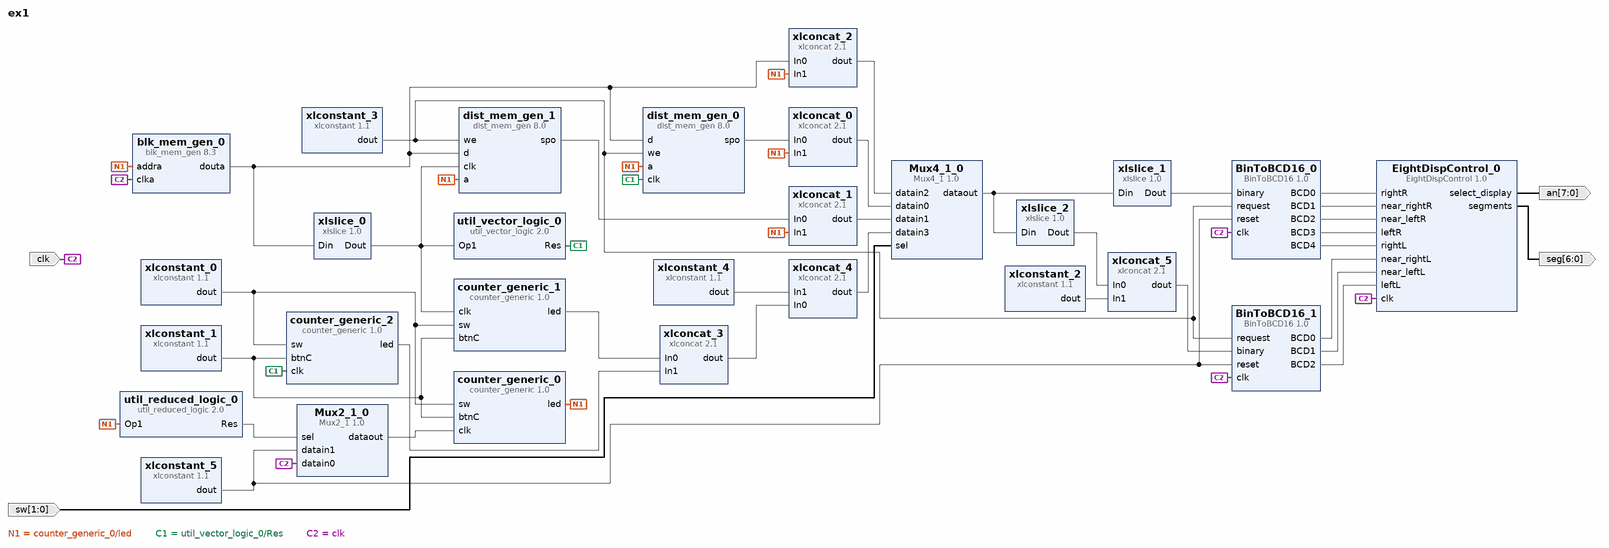
[diagram p0: block diagram of the top level]
# Vivado block design ex1, xc7a100tcsg324-3, Vivado 2016.4
create_bd_design ex1

create_bd_port -dir I clk
create_bd_port -dir I -from 1 -to 0 sw
create_bd_port -dir O -from 6 -to 0 seg
create_bd_port -dir O -from 7 -to 0 an

create_bd_cell -type ip -vlnv xilinx.com:ip:blk_mem_gen:8.3 blk_mem_gen_0
set_property -dict [list \
  CONFIG.Memory_Type Single_Port_ROM \
  CONFIG.Enable_32bit_Address false \
  CONFIG.Write_Width_A 16 \
  CONFIG.Enable_A Always_Enabled \
  CONFIG.Register_PortA_Output_of_Memory_Primitives true \
  CONFIG.Load_Init_File true \
  CONFIG.Coe_File ../../../../../../vector128_16bits_random.coe \
  CONFIG.Fill_Remaining_Memory_Locations true \
  CONFIG.Use_RSTA_Pin false \
  CONFIG.Port_A_Write_Rate 0 \
  CONFIG.use_bram_block Stand_Alone \
] [get_bd_cells blk_mem_gen_0]
create_bd_cell -type ip -vlnv xilinx.com:ip:dist_mem_gen:8.0 dist_mem_gen_0
set_property -dict {CONFIG.depth 128} [get_bd_cells dist_mem_gen_0]
create_bd_cell -type ip -vlnv xilinx.com:ip:dist_mem_gen:8.0 dist_mem_gen_1
set_property -dict {CONFIG.depth 128} [get_bd_cells dist_mem_gen_1]
create_bd_cell -type ip -vlnv xilinx.com:ip:xlslice:1.0 xlslice_0
set_property -dict {CONFIG.DIN_TO 0 CONFIG.DIN_FROM 0 CONFIG.DIN_WIDTH 16} [get_bd_cells xlslice_0]
create_bd_cell -type ip -vlnv xilinx.com:user:counter_generic:1.0 counter_generic_0
set_property -dict {CONFIG.nr_bits 7} [get_bd_cells counter_generic_0]
create_bd_cell -type ip -vlnv xilinx.com:ip:xlconstant:1.1 xlconstant_0
set_property -dict {CONFIG.CONST_WIDTH 2} [get_bd_cells xlconstant_0]
create_bd_cell -type ip -vlnv xilinx.com:ip:xlconstant:1.1 xlconstant_1
set_property -dict {CONFIG.CONST_VAL 0} [get_bd_cells xlconstant_1]
create_bd_cell -type ip -vlnv xilinx.com:user:Mux4_1:1.0 Mux4_1_0
set_property -dict {CONFIG.number_of_bits 23} [get_bd_cells Mux4_1_0]
create_bd_cell -type ip -vlnv xilinx.com:ip:xlconcat:2.1 xlconcat_0
set_property -dict {CONFIG.IN0_WIDTH 16 CONFIG.IN1_WIDTH 7} [get_bd_cells xlconcat_0]
create_bd_cell -type ip -vlnv xilinx.com:ip:xlconcat:2.1 xlconcat_1
set_property -dict {CONFIG.IN0_WIDTH 16 CONFIG.IN1_WIDTH 7} [get_bd_cells xlconcat_1]
create_bd_cell -type ip -vlnv xilinx.com:ip:xlconcat:2.1 xlconcat_2
set_property -dict {CONFIG.IN0_WIDTH 16 CONFIG.IN1_WIDTH 7} [get_bd_cells xlconcat_2]
create_bd_cell -type ip -vlnv xilinx.com:ip:xlslice:1.0 xlslice_1
set_property -dict {CONFIG.DOUT_WIDTH 16 CONFIG.DIN_TO 0 CONFIG.DIN_FROM 15 CONFIG.DIN_WIDTH 23} [get_bd_cells xlslice_1]
create_bd_cell -type ip -vlnv xilinx.com:ip:xlslice:1.0 xlslice_2
set_property -dict {CONFIG.DOUT_WIDTH 7 CONFIG.DIN_TO 16 CONFIG.DIN_FROM 22 CONFIG.DIN_WIDTH 23} [get_bd_cells xlslice_2]
create_bd_cell -type ip -vlnv xilinx.com:ip:xlconcat:2.1 xlconcat_5
set_property -dict {CONFIG.IN0_WIDTH 7 CONFIG.IN1_WIDTH 9} [get_bd_cells xlconcat_5]
create_bd_cell -type ip -vlnv xilinx.com:ip:xlconstant:1.1 xlconstant_2
set_property -dict {CONFIG.CONST_WIDTH 9 CONFIG.CONST_VAL 0} [get_bd_cells xlconstant_2]
create_bd_cell -type ip -vlnv ua.pt:user:BinToBCD16:1.0 BinToBCD16_0
create_bd_cell -type ip -vlnv ua.pt:user:BinToBCD16:1.0 BinToBCD16_1
create_bd_cell -type ip -vlnv xilinx.com:ip:xlconstant:1.1 xlconstant_3
create_bd_cell -type ip -vlnv ua.pt:user:EightDispControl:1.0 EightDispControl_0
create_bd_cell -type ip -vlnv xilinx.com:ip:util_vector_logic:2.0 util_vector_logic_0
set_property -dict {CONFIG.C_SIZE 1 CONFIG.C_OPERATION not} [get_bd_cells util_vector_logic_0]
create_bd_cell -type ip -vlnv xilinx.com:ip:xlconstant:1.1 xlconstant_5
set_property -dict {CONFIG.CONST_VAL 0} [get_bd_cells xlconstant_5]
create_bd_cell -type ip -vlnv xilinx.com:user:counter_generic:1.0 counter_generic_1
set_property -dict {CONFIG.nr_bits 7} [get_bd_cells counter_generic_1]
create_bd_cell -type ip -vlnv xilinx.com:user:counter_generic:1.0 counter_generic_2
set_property -dict {CONFIG.nr_bits 7} [get_bd_cells counter_generic_2]
create_bd_cell -type ip -vlnv xilinx.com:ip:xlconcat:2.1 xlconcat_3
set_property -dict {CONFIG.IN0_WIDTH 7 CONFIG.IN1_WIDTH 7} [get_bd_cells xlconcat_3]
create_bd_cell -type ip -vlnv xilinx.com:user:Mux2_1:1.0 Mux2_1_0
set_property -dict {CONFIG.number_of_bits 1} [get_bd_cells Mux2_1_0]
create_bd_cell -type ip -vlnv xilinx.com:ip:util_reduced_logic:2.0 util_reduced_logic_0
set_property -dict {CONFIG.C_SIZE 7 CONFIG.C_OPERATION and} [get_bd_cells util_reduced_logic_0]
create_bd_cell -type ip -vlnv xilinx.com:ip:xlconcat:2.1 xlconcat_4
set_property -dict {CONFIG.IN0_WIDTH 14 CONFIG.IN1_WIDTH 9} [get_bd_cells xlconcat_4]
create_bd_cell -type ip -vlnv xilinx.com:ip:xlconstant:1.1 xlconstant_4
set_property -dict {CONFIG.CONST_WIDTH 9 CONFIG.CONST_VAL 0} [get_bd_cells xlconstant_4]

# ---- connections ----

connect_bd_net [get_bd_pins counter_generic_0/led] \
  [get_bd_pins blk_mem_gen_0/addra] [get_bd_pins xlconcat_2/In1] [get_bd_pins dist_mem_gen_1/a] \
  [get_bd_pins dist_mem_gen_0/a] [get_bd_pins xlconcat_1/In1] [get_bd_pins xlconcat_0/In1] \
  [get_bd_pins util_reduced_logic_0/Op1]
connect_bd_net [get_bd_pins xlconstant_0/dout] \
  [get_bd_pins counter_generic_0/sw] [get_bd_pins counter_generic_1/sw] [get_bd_pins counter_generic_2/sw]
connect_bd_net [get_bd_pins xlconstant_1/dout] \
  [get_bd_pins counter_generic_0/btnC] [get_bd_pins counter_generic_2/btnC] [get_bd_pins counter_generic_1/btnC]
connect_bd_net [get_bd_pins dist_mem_gen_0/spo] [get_bd_pins xlconcat_0/In0]
connect_bd_net [get_bd_pins xlconcat_0/dout] [get_bd_pins Mux4_1_0/datain0]
connect_bd_net [get_bd_pins dist_mem_gen_1/spo] [get_bd_pins xlconcat_1/In0]
connect_bd_net [get_bd_pins xlconcat_1/dout] [get_bd_pins Mux4_1_0/datain1]
connect_bd_net [get_bd_pins xlconcat_2/dout] [get_bd_pins Mux4_1_0/datain2]
connect_bd_net [get_bd_ports sw] [get_bd_pins Mux4_1_0/sel]
connect_bd_net [get_bd_pins Mux4_1_0/dataout] [get_bd_pins xlslice_1/Din] [get_bd_pins xlslice_2/Din]
connect_bd_net [get_bd_pins xlconstant_2/dout] [get_bd_pins xlconcat_5/In1]
connect_bd_net [get_bd_pins xlslice_2/Dout] [get_bd_pins xlconcat_5/In0]
connect_bd_net [get_bd_pins xlconcat_5/dout] [get_bd_pins BinToBCD16_1/binary]
connect_bd_net [get_bd_pins xlslice_1/Dout] [get_bd_pins BinToBCD16_0/binary]
connect_bd_net [get_bd_pins BinToBCD16_0/BCD0] [get_bd_pins EightDispControl_0/rightR]
connect_bd_net [get_bd_pins BinToBCD16_0/BCD1] [get_bd_pins EightDispControl_0/near_rightR]
connect_bd_net [get_bd_pins BinToBCD16_0/BCD2] [get_bd_pins EightDispControl_0/near_leftR]
connect_bd_net [get_bd_pins BinToBCD16_0/BCD3] [get_bd_pins EightDispControl_0/leftR]
connect_bd_net [get_bd_pins BinToBCD16_0/BCD4] [get_bd_pins EightDispControl_0/rightL]
connect_bd_net [get_bd_pins BinToBCD16_1/BCD0] [get_bd_pins EightDispControl_0/near_rightL]
connect_bd_net [get_bd_pins BinToBCD16_1/BCD1] [get_bd_pins EightDispControl_0/near_leftL]
connect_bd_net [get_bd_pins BinToBCD16_1/BCD2] [get_bd_pins EightDispControl_0/leftL]
connect_bd_net [get_bd_pins EightDispControl_0/segments] [get_bd_ports seg]
connect_bd_net [get_bd_pins EightDispControl_0/select_display] [get_bd_ports an]
connect_bd_net [get_bd_pins xlconstant_3/dout] \
  [get_bd_pins BinToBCD16_1/request] [get_bd_pins BinToBCD16_0/request] [get_bd_pins dist_mem_gen_1/we] \
  [get_bd_pins dist_mem_gen_0/we]
connect_bd_net [get_bd_pins xlconstant_5/dout] [get_bd_pins BinToBCD16_0/reset] [get_bd_pins BinToBCD16_1/reset] [get_bd_pins Mux2_1_0/datain1]
connect_bd_net [get_bd_pins counter_generic_1/led] [get_bd_pins xlconcat_3/In0]
connect_bd_net [get_bd_pins counter_generic_2/led] [get_bd_pins xlconcat_3/In1]
connect_bd_net [get_bd_pins util_vector_logic_0/Res] [get_bd_pins dist_mem_gen_0/clk] [get_bd_pins counter_generic_2/clk]
connect_bd_net [get_bd_pins xlslice_0/Dout] [get_bd_pins util_vector_logic_0/Op1] [get_bd_pins dist_mem_gen_1/clk] [get_bd_pins counter_generic_1/clk]
connect_bd_net [get_bd_ports clk] \
  [get_bd_pins Mux2_1_0/datain0] [get_bd_pins BinToBCD16_1/clk] [get_bd_pins BinToBCD16_0/clk] \
  [get_bd_pins EightDispControl_0/clk] [get_bd_pins blk_mem_gen_0/clka]
connect_bd_net [get_bd_pins xlconcat_3/dout] [get_bd_pins xlconcat_4/In0]
connect_bd_net [get_bd_pins xlconstant_4/dout] [get_bd_pins xlconcat_4/In1]
connect_bd_net [get_bd_pins xlconcat_4/dout] [get_bd_pins Mux4_1_0/datain3]
connect_bd_net [get_bd_pins Mux2_1_0/dataout] [get_bd_pins counter_generic_0/clk]
connect_bd_net [get_bd_pins util_reduced_logic_0/Res] [get_bd_pins Mux2_1_0/sel]
connect_bd_net [get_bd_pins blk_mem_gen_0/douta] \
  [get_bd_pins xlslice_0/Din] [get_bd_pins dist_mem_gen_1/d] [get_bd_pins dist_mem_gen_0/d] [get_bd_pins xlconcat_2/In0]

validate_bd_design
save_bd_design
